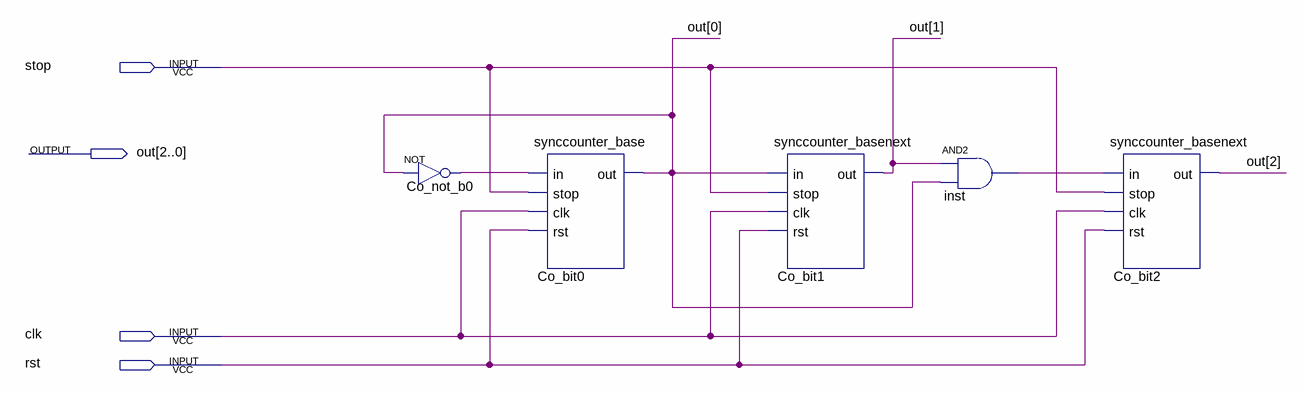
[diagram p0: schematic sheet]
// Quartus schematic synccounter3.bdf as structural Verilog: 5 symbols, 4 pins
module synccounter3 (
  input  stop,
  input  clk,
  input  rst,
  output [2:0] out
);

  wire Co_not_b0_out, inst_out;

  not Co_not_b0 (Co_not_b0_out, out[0]);
  synccounter_base Co_bit0 (.in(Co_not_b0_out), .stop(stop), .clk(clk), .rst(rst), .out(out[0]));
  synccounter_basenext Co_bit1 (.in(out[0]), .stop(stop), .clk(clk), .rst(rst), .out(out[1]));
  and inst (inst_out, out[1], out[0]);
  synccounter_basenext Co_bit2 (.in(inst_out), .stop(stop), .clk(clk), .rst(rst), .out(out[2]));
endmodule
